# EasyEDA Pro project HDMI_To_AV.epro

# Schematic schematic1
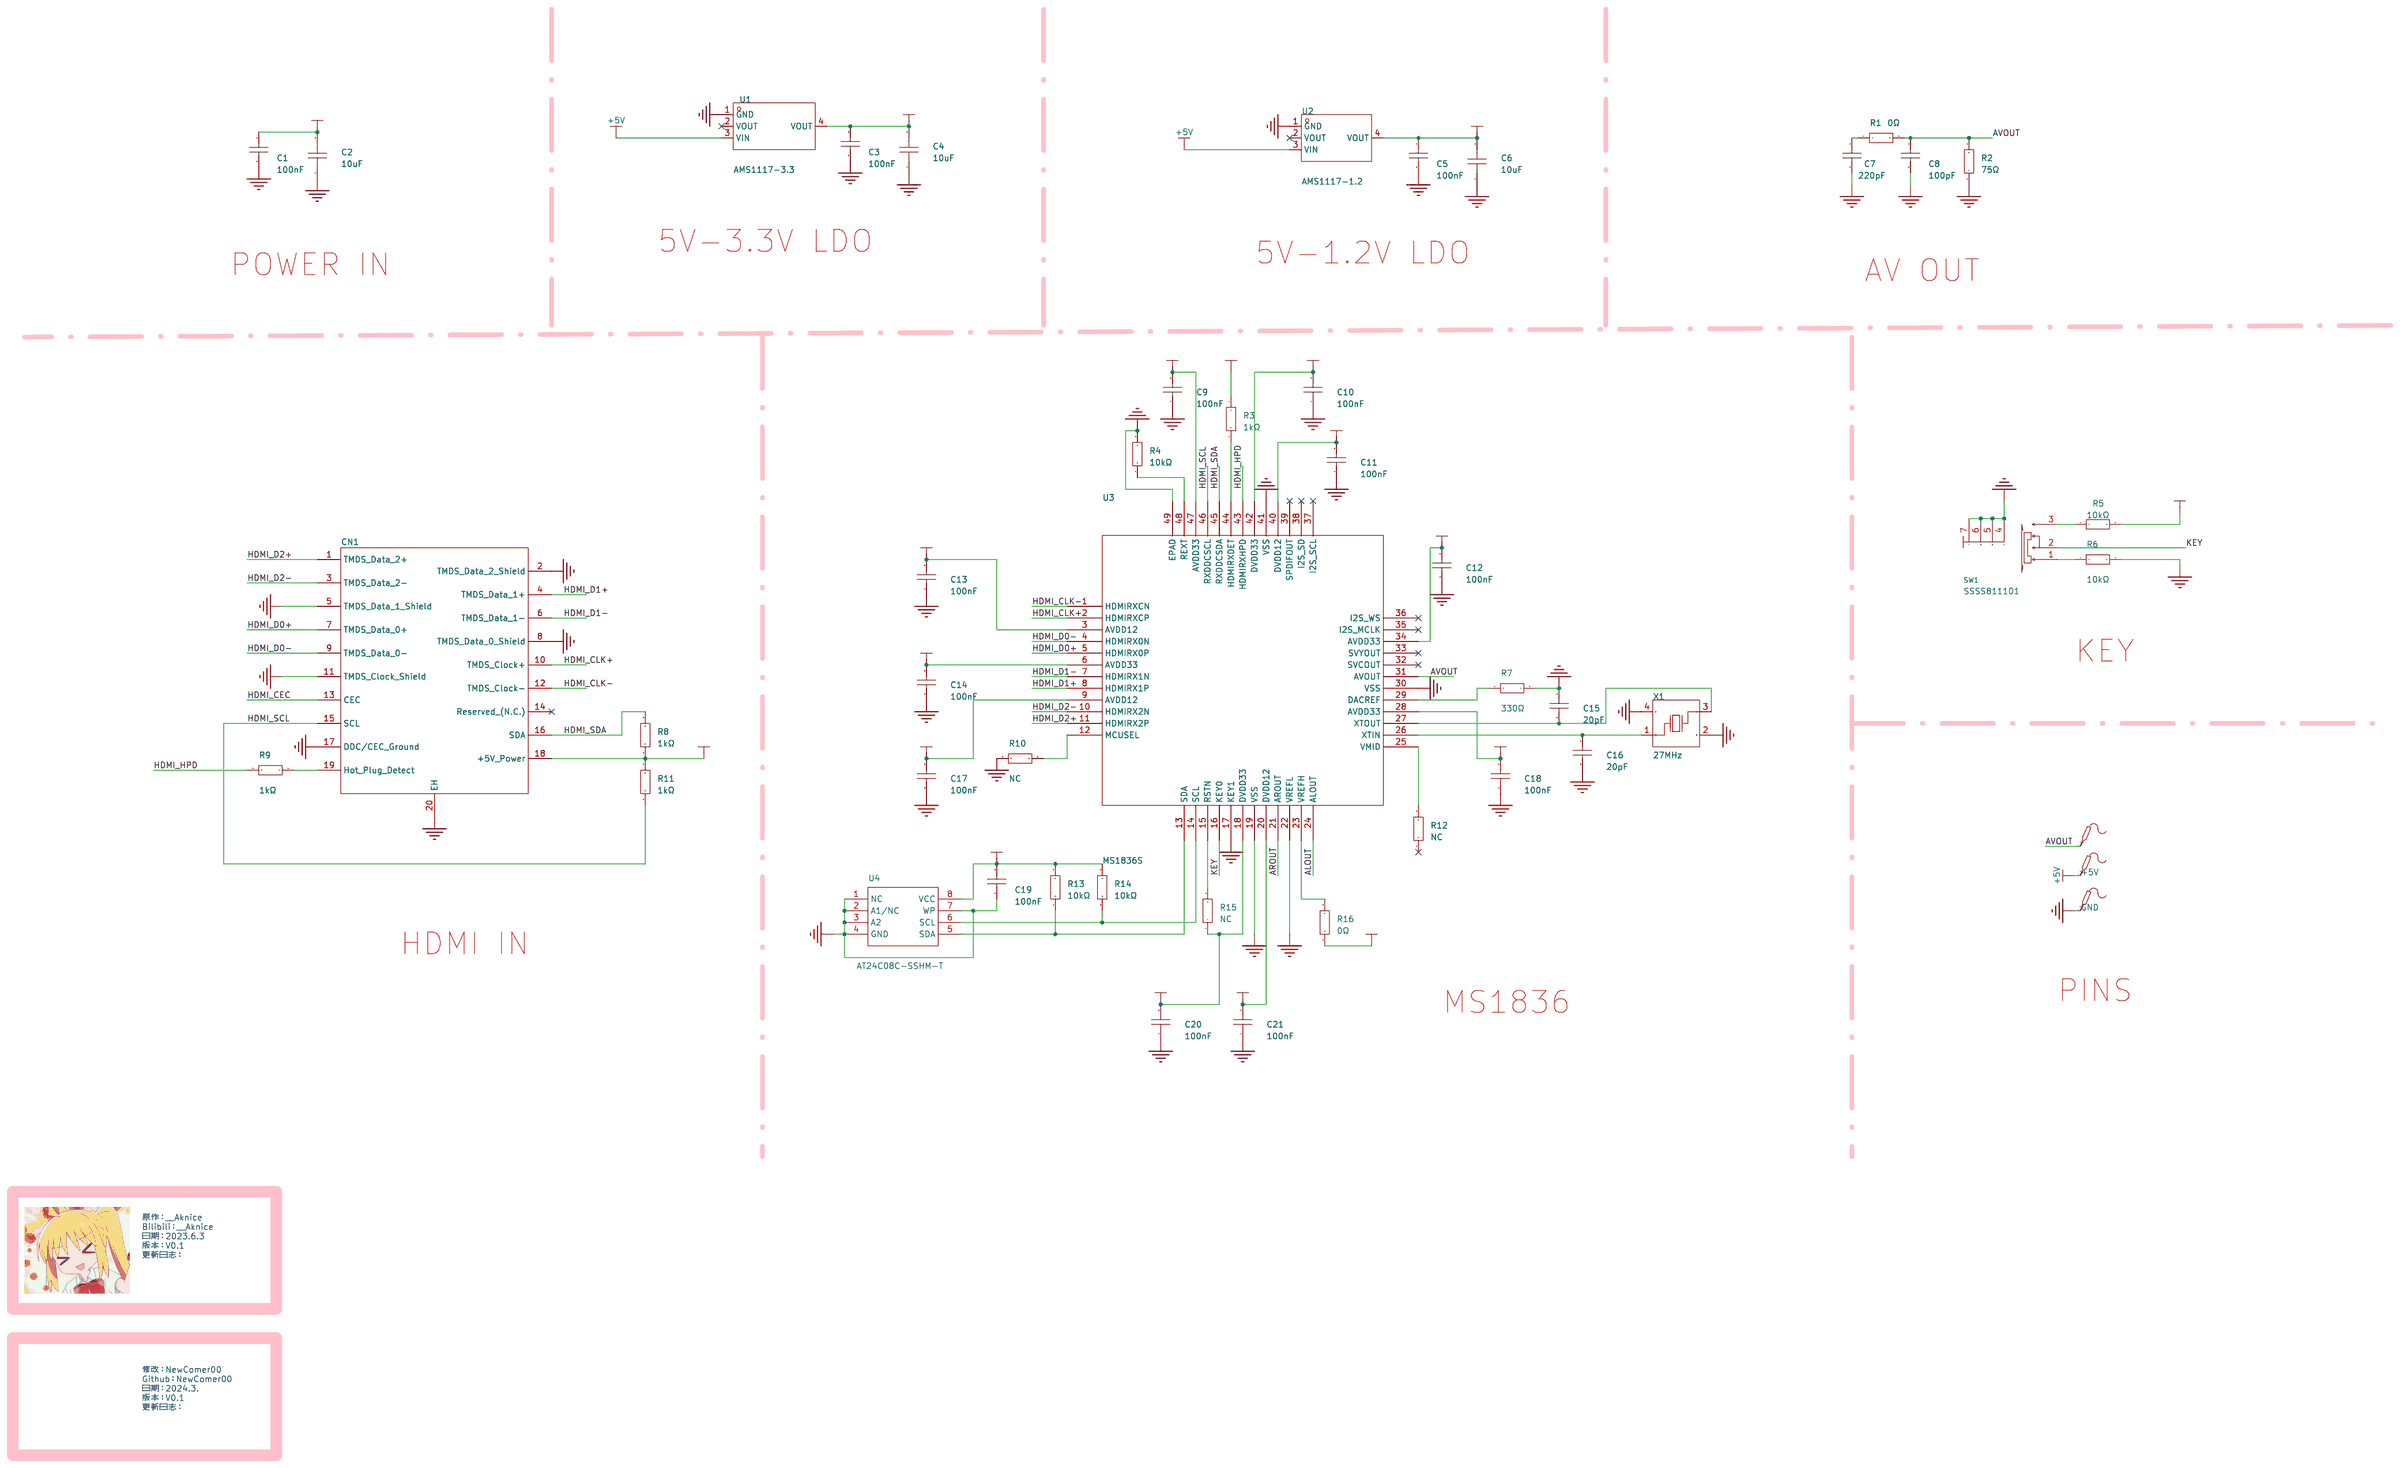
[diagram p0: schematic sheet]

## Parts
+5V  -  [Test-Point-0.5mm]
AVOUT  -  [Test-Point-0.5mm]
C1  100nF  [C0402]
C2  10uF  [C0603]
C3  100nF  [C0402]
C4  10uF  [C0603]
C5  100nF  [C0402]
C6  10uF  [C0603]
C7  220pF  [C0402]
C8  100pF  [C0402]
C9  100nF  [C0402]
C10  100nF  [C0402]
C11  100nF  [C0402]
C12  100nF  [C0402]
C13  100nF  [C0402]
C14  100nF  [C0402]
C15  20pF  [C0402]
C16  20pF  [C0402]
C17  100nF  [C0402]
C18  100nF  [C0402]
C19  100nF  [C0402]
C20  100nF  [C0402]
C21  100nF  [C0402]
CN1  HDMI-019A  [HDMI-TH_HDMI-019A]
GND  -  [Test-Point-0.5mm]
R1  0Ω  [R0805]
R2  75Ω  [R0402]
R3  1kΩ  [R0402]
R4  10kΩ  [R0402]
R5  10kΩ  [R0402]
R6  10kΩ  [R0402]
R7  330Ω  [R0402]
R8  1kΩ  [R0402]
R9  1kΩ  [R0402]
R10  NC  [R0402]
R11  1kΩ  [R0402]
R12  NC  [R0402]
R13  10kΩ  [R0402]
R14  10kΩ  [R0402]
R15  NC  [R0402]
R16  0Ω  [R0402]
SW1  SSSS811101  [SW-SMD_SSSS811101]
U1  AMS1117-3.3  [SOT-223-3_L6.5-W3.4-P2.30-LS7.0-BR]
U2  AMS1117-1.2  [SOT-223-3_L6.7-W3.7-P2.30-LS7.0-BR]
U3  MS1836S  [QFN-48_L7.0-W7.0-P0.50-TL-EP5.4]
U4  AT24C08C-SSHM-T  [SOIC-8_L5.0-W4.0-P1.27-LS6.0-BL]
X1  27MHz  [OSC-SMD_4P-L3.2-W2.5-BL]

## Library data of the parts
+5V AVOUT GND = Test-Point: Test Point 测试点
C1 C3 C5 C9-C14 C17-C21 = CL05B104KO5NNNC: 容值:100nF;精度:±10%;额定电压:16V;材质(温度系数):X7R;; LCSC Part Name: 100nF ±10% 16V; Supplier Part: C1525; Manufacturer: SAMSUNG(三星); Supplier Footprint: 0402; JLCPCB Part Class: 基础库; Datasheet: https://atta.szlcsc.com/upload/public/pdf/source/20160103/1457707674891.pdf; Supplier: LCSC; Tolerance: ±10%; Voltage Rated: 16V; Temperature Coefficient: X7R
C2 C4 C6 = CL10A106KP8NNNC: 容值:10uF;精度:±10%;额定电压:10V;材质(温度系数):X5R;; LCSC Part Name: 10uF ±10% 10V; Supplier Part: C19702; Manufacturer: SAMSUNG(三星); Supplier Footprint: 0603; JLCPCB Part Class: 基础库; Datasheet: https://atta.szlcsc.com/upload/public/pdf/source/20160103/1457707703378.pdf; Supplier: LCSC; Tolerance: ±10%; Voltage Rated: 10V; Temperature Coefficient: X5R
C7 = 0402B221K500NT: 容值:220pF;精度:±10%;额定电压:50V;材质(温度系数):X7R;; LCSC Part Name: 220pF ±10% 50V; Supplier Part: C1530; Manufacturer: FH(风华); Supplier Footprint: 0402; JLCPCB Part Class: 基础库; Datasheet: https://atta.szlcsc.com/upload/public/pdf/source/20170923/C1530_1506149257934988337.pdf; Supplier: LCSC; Tolerance: ±10%; Voltage Rated: 50V; Temperature Coefficient: X7R
C8 = 0402CG101J500NT: 容值:100pF;精度:±5%;额定电压:50V;材质(温度系数):C0G;; LCSC Part Name: 100pF ±5% 50V; Supplier Part: C1546; Manufacturer: FH(风华); Supplier Footprint: 0402; JLCPCB Part Class: 基础库; Datasheet: https://atta.szlcsc.com/upload/public/pdf/source/20170923/C1546_1506149265265988353.pdf; Supplier: LCSC; Tolerance: ±5%; Voltage Rated: 50V; Temperature Coefficient: C0G
C15 C16 = 0402CG200J500NT: 容值:20pF;精度:±5%;额定电压:50V;材质(温度系数):C0G;; LCSC Part Name: 20pF ±5% 50V; Supplier Part: C1554; Manufacturer: FH(风华); Supplier Footprint: 0402; JLCPCB Part Class: 基础库; Datasheet: https://atta.szlcsc.com/upload/public/pdf/source/20170923/C1554_1506149268708988361.pdf; Supplier: LCSC; Tolerance: ±5%; Voltage Rated: 50V; Temperature Coefficient: C0G
CN1 = HDMI-019A: 连接器类型:HDMI;公母:母;总PIN位数:19;排数:-;安装方式:弯插;额定电流:500mA;工作温度范围:-25~+75;; LCSC Part Name: HDMI 母 P数:19; Supplier Part: C369072; Manufacturer: SOFNG(硕方); Supplier Footprint: 插件; JLCPCB Part Class: 扩展库; Datasheet: https://atta.szlcsc.com/upload/public/pdf/source/20191127/C369072_B9A70961842C25AB549748627DCDC9C3.pdf; Supplier: LCSC; Connector Type: HDMI; Gender: 母; Number of Pins: 19; Mounting Style: 弯插; Current Rating (Max): 500mA; Operating Temperature Range: -25~+75
R1 = 0805W8F0000T5E: 电阻类型:厚膜电阻;阻值:0Ω;精度:±1%;功率:125mW;; LCSC Part Name: 0Ω ±1% 125mW; Supplier Part: C17477; Manufacturer: UNI-ROYAL(厚声); Supplier Footprint: 0805; JLCPCB Part Class: Basic Part; Datasheet: https://atta.szlcsc.com/upload/public/pdf/source/20200306/C422600_1E6D84923E4A46A82E41ADD87F860B5C.pdf; Supplier: LCSC; Type: 厚膜电阻; Tolerance: ±1%; Power(Watts): 125mW; Temperature Coefficient: ±800ppm/℃; Overload Voltage (Max): 150V; Operating Temperature Range: -55℃~+155℃
R2 = 0402WGF750JTCE: 电阻类型:厚膜电阻;阻值:75Ω;精度:±1%;功率:62.5mW;; LCSC Part Name: 75Ω ±1% 62.5mW; Supplier Part: C25133; Manufacturer: UNI-ROYAL(厚声); Supplier Footprint: 0402; JLCPCB Part Class: Basic Part; Datasheet: https://atta.szlcsc.com/upload/public/pdf/source/20200306/C422600_1E6D84923E4A46A82E41ADD87F860B5C.pdf; Supplier: LCSC; Type: 厚膜电阻; Tolerance: ±1%; Power(Watts): 62.5mW; Temperature Coefficient: ±100ppm/℃; Overload Voltage (Max): 50V; Operating Temperature Range: -55℃~+155℃
R3 R8 R9 R11 = 0402WGJ0102TCE: 电阻类型:厚膜电阻;阻值:1kΩ;精度:±5%;功率:62.5mW;; LCSC Part Name: 1kΩ ±5% 62.5mW; Supplier Part: C25543; Manufacturer: UNI-ROYAL(厚声); Supplier Footprint: 0402; JLCPCB Part Class: Extended Part; Datasheet: https://atta.szlcsc.com/upload/public/pdf/source/20200306/C422600_1E6D84923E4A46A82E41ADD87F860B5C.pdf; Supplier: LCSC; Type: 厚膜电阻; Tolerance: ±5%; Power(Watts): 62.5mW; Temperature Coefficient: ±100ppm/℃; Overload Voltage (Max): 50V; Operating Temperature Range: -55℃~+155℃
R4-R6 R13 R14 = 0402WGF1002TCE: 电阻类型:厚膜电阻;阻值:10kΩ;精度:±1%;功率:62.5mW;; LCSC Part Name: 10kΩ ±1% 62.5mW; Supplier Part: C25744; Manufacturer: UNI-ROYAL(厚声); Supplier Footprint: 0402; JLCPCB Part Class: Basic Part; Datasheet: https://atta.szlcsc.com/upload/public/pdf/source/20200306/C422600_1E6D84923E4A46A82E41ADD87F860B5C.pdf; Supplier: LCSC; Type: 厚膜电阻; Tolerance: ±1%; Power(Watts): 62.5mW; Temperature Coefficient: ±100ppm/℃; Overload Voltage (Max): 50V; Operating Temperature Range: -55℃~+155℃
R7 = 0402WGF3300TCE: 电阻类型:厚膜电阻;阻值:330Ω;精度:±1%;功率:62.5mW;; LCSC Part Name: 330Ω ±1% 62.5mW; Supplier Part: C25104; Manufacturer: UNI-ROYAL(厚声); Supplier Footprint: 0402; JLCPCB Part Class: 基础库; Datasheet: https://atta.szlcsc.com/upload/public/pdf/source/20200306/C422600_1E6D84923E4A46A82E41ADD87F860B5C.pdf; Supplier: LCSC; Type: 厚膜电阻; Tolerance: ±1%; Power(Watts): 62.5mW; Temperature Coefficient: ±100ppm/℃; Overload Voltage (Max): 50V; Operating Temperature Range: -55℃~+155℃
R10 R12 R15 R16 = 0402WGF0000TCE: 电阻类型:厚膜电阻;阻值:0Ω;精度:±1%;功率:62.5mW;; LCSC Part Name: 0Ω ±1% 62.5mW; Supplier Part: C17168; Manufacturer: UNI-ROYAL(厚声); Supplier Footprint: 0402; JLCPCB Part Class: 基础库; Datasheet: https://atta.szlcsc.com/upload/public/pdf/source/20200306/C422600_1E6D84923E4A46A82E41ADD87F860B5C.pdf; Supplier: LCSC; Type: 厚膜电阻; Tolerance: ±1%; Power(Watts): 62.5mW; Temperature Coefficient: ±800ppm/℃; Overload Voltage (Max): 50V; Operating Temperature Range: -55℃~+155℃
SW1 = SSSS811101: 电路结构:单刀双掷;安装方式:卧贴;额定电流(DC):300mA;额定电压(DC):5V;额定电流(AC):-;额定电压(AC):-;机械寿命:1万次;; Supplier Part: C109335; Manufacturer: ALPSALPINE(阿尔卑斯阿尔派); Supplier Footprint: SMD; JLCPCB Part Class: 扩展库; Datasheet: https://atta.szlcsc.com/upload/public/pdf/source/20170620/1497944730069.pdf; Supplier: LCSC; Circuit: 单刀双掷; Actuator Style: 矩形柱状; Pin Style: SMD接片; Switch Height: 4.1mm; Mounting Style: 卧贴; Current Rating (DC): 300mA; Voltage Rating (DC): 5V; Mechanical Life: 1万次; Operating Temperature: -40℃~+85℃
U1 = AMS1117-3.3_C6186: 输出类型:固定;输出极性:正;最大输入电压:-;输出电压:3.3V;输出电流:1A;电源纹波抑制比(PSRR):72dB@(120Hz);; LCSC Part Name: 输出3.3V 1A; Supplier Part: C6186; Manufacturer: AMS; Supplier Footprint: SOT-223; JLCPCB Part Class: Basic Part; Datasheet: https://atta.szlcsc.com/upload/public/pdf/source/20180727/C6186_7A095716F0823C02F1997A905E26C086.pdf; Supplier: LCSC; Output Type: 固定; Output Polarity: 正; Number of Outputs: 1; Output Voltage: 3.3V; Dropout Voltage: 1.3V@(800mA); Output Current: 1A; Power Supply Rejection Ratio (PSRR): 72dB@(120Hz)
U2 = AMS1117-1.2_C963402: 输出类型:-;; Supplier Part: C963402; Manufacturer: JSMSEMI(杰盛微); Supplier Footprint: SOT-223-3; JLCPCB Part Class: 扩展库; Datasheet: https://atta.szlcsc.com/upload/public/pdf/source/20211201/578FEEF9766904D398893791CE3EC879.pdf; Supplier: LCSC
U3 = MS1836S
U4 = AT24C08C-SSHM-T: 接口类型:I2C;存储容量:8Kbit;; Supplier Part: C31422; Manufacturer: MICROCHIP(美国微芯); Supplier Footprint: SOIC-8; JLCPCB Part Class: 扩展库; Datasheet: https://atta.szlcsc.com/upload/public/pdf/source/20210426/C31422_4DD9E0195B8FA1A8955CD672FFF5D6C7.pdf; Supplier: LCSC; Interface Type: I2C; Memory Size: 8Kbit; Supply Voltage: 1.7V~5.5V; Operating Temperature: -40℃~85℃
X1 = X322527MSB4SI: 频率:27MHz;频率公差:±10ppm;负载电容:20pF;; LCSC Part Name: 27MHz ±10ppm 20pF; Supplier Part: C9008; Manufacturer: YXC(扬兴晶振); Supplier Footprint: SMD3225-4P; JLCPCB Part Class: 扩展库; Datasheet: https://atta.szlcsc.com/upload/public/pdf/source/20210924/6E7747CDA2F2290AC736DA7D858AE7E6.pdf; Supplier: LCSC; Crystal Type: 贴片无源晶振; Frequency Tolerance: ±10ppm; Frequency Stability: ±30ppm; Load Capacitance: 20pF; Operating Temperature: -40℃~+85℃

## Nets
+1.2V: C5.2 C6.2 C11.2 C13.2 C17.2 C21.2 U2.4(VOUT) U3.3(AVDD12) U3.9(AVDD12) U3.20(DVDD12) U3.40(DVDD12)
+3.3V: C3.2 C4.2 C9.2 C10.2 C12.2 C14.2 C18.2 C19.2 C20.2 R5.2 R13.2 R14.2 R15.1 R16.1 U1.4(VOUT) U3.6(AVDD33) U3.18(DVDD33) U3.28(AVDD33) U3.34(AVDD33) U3.42(DVDD33) U3.47(AVDD33) U4.8(VCC)
+5V: +5V.1 C1.2 C2.2 U1.3(VIN) U2.3(VIN)
GND: C1.1 C2.1 C3.1 C4.1 C5.1 C6.1 C7.1 C8.1 C9.1 C10.1 C11.1 C12.1 C13.1 C14.1 C15.2 C16.1 C17.1 C18.1 C19.1 C20.1 C21.1 CN1.2(TMDS Data 2 Shield) CN1.5(TMDS Data 1 Shield) CN1.8(TMDS Data 0 Shield) CN1.11(TMDS Clock Shield) CN1.17(DDC/CEC Ground) CN1.20(EH) GND.1 R2.1 R4.2 R6.2 R7.2 R10.2 SW1.4 SW1.5 SW1.6 SW1.7 U1.1(GND) U2.1(GND) U3.17(KEY1) U3.19(VSS) U3.22(VREFL) U3.30(VSS) U3.41(VSS) U3.49(EPAD) U4.1(NC) U4.2(A1/NC) U4.3(A2) U4.4(GND) U4.7(WP) X1.2(GND) X1.4(GND)
ALOUT: U3.24(ALOUT)
AROUT: U3.21(AROUT)
AVOUT: AVOUT.1 C8.2 R1.2 R2.2 U3.31(AVOUT)
HDMI_CEC: CN1.13(CEC)
HDMI_CLK+: CN1.10(TMDS Clock+) U3.2(HDMIRXCP)
HDMI_CLK-: CN1.12(TMDS Clock-) U3.1(HDMIRXCN)
HDMI_D0+: CN1.7(TMDS Data 0+) U3.5(HDMIRX0P)
HDMI_D0-: CN1.9(TMDS Data 0-) U3.4(HDMIRX0N)
HDMI_D1+: CN1.4(TMDS Data 1+) U3.8(HDMIRX1P)
HDMI_D1-: CN1.6(TMDS Data 1-) U3.7(HDMIRX1N)
HDMI_D2+: CN1.1(TMDS Data 2+) U3.11(HDMIRX2P)
HDMI_D2-: CN1.3(TMDS Data 2-) U3.10(HDMIRX2N)
HDMI_HPD: R9.2 U3.43(HDMIRXHPD)
HDMI_SCL: CN1.15(SCL) R11.1 U3.46(RXDDCSCL)
HDMI_SDA: CN1.16(SDA) R8.2 U3.45(RXDDCSDA)
KEY: SW1.2 U3.16(KEY0)
RX5V: CN1.18(+5V Power) R3.1 R8.1 R11.2
$1N3947: C7.2 R1.1
$1N4157: CN1.19(Hot Plug Detect) R9.1
$1N4897: R14.1 U3.14(SCL) U4.6(SCL)
$1N4904: R13.1 U3.13(SDA) U4.5(SDA)
$1N5015: C16.2 U3.26(XTIN) X1.1(OSC1)
$1N5018: C15.1 U3.27(XTOUT) X1.3(OSC2)
$1N5095: R12.2 U3.25(VMID)
$1N5166: R7.1 U3.29(DACREF)
$1N5224: R4.1 U3.48(REXT)
$1N5407: R3.2 U3.44(HDMIRXDET)
$1N5897: R16.2 U3.23(VREFH)
$1N6045: R15.2 U3.15(RSTN)
$1N6128: R10.1 U3.12(MCUSEL)
$1N14503: R6.1 SW1.1
$1N14505: R5.1 SW1.3

Not connected (* = marked no-connect by the designer): CN1 14(Reserved (N.C.))*; R12 1*; U1 2(VOUT)*; U2 2(VOUT)*; U3 32(SVCOUT)* 33(SVYOUT)* 35(I2S_MCLK)* 36(I2S_WS)* 37(I2S_SCL)* 38(I2S_SD)* 39(SPDIFOUT)*

## Notes on the sheet
- 5V-3.3V LDO
- POWER IN
- 5V-1.2V LDO
- AV OUT
- KEY
- HDMI IN
- PINS
- MS1836
- 原作：__Aknice
  Bilibili：__Aknice
  日期：2023.6.3
  版本：V0.1
  更新日志：
- 修改：NewComer00
  Github：NewComer00
  日期：2024.3.
  版本：V0.1
  更新日志：

# Board PCB1
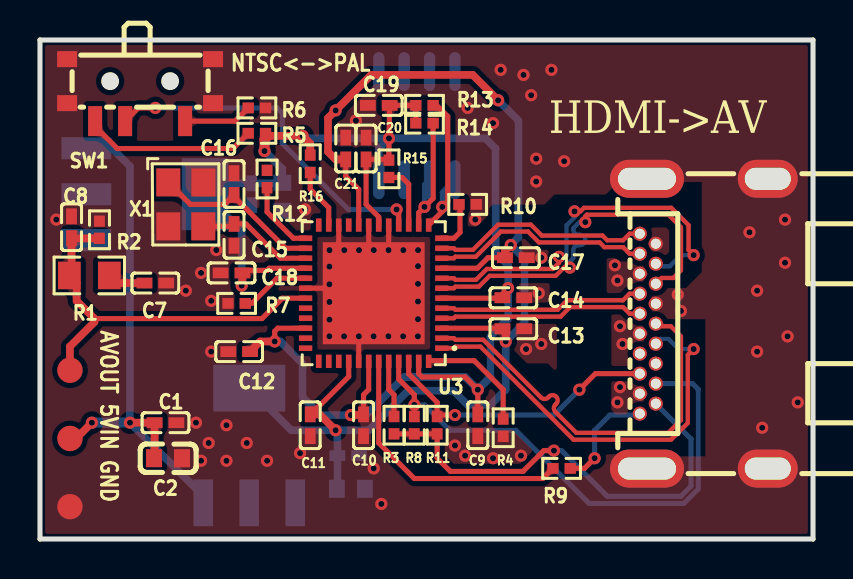
[diagram p1: board, top side]
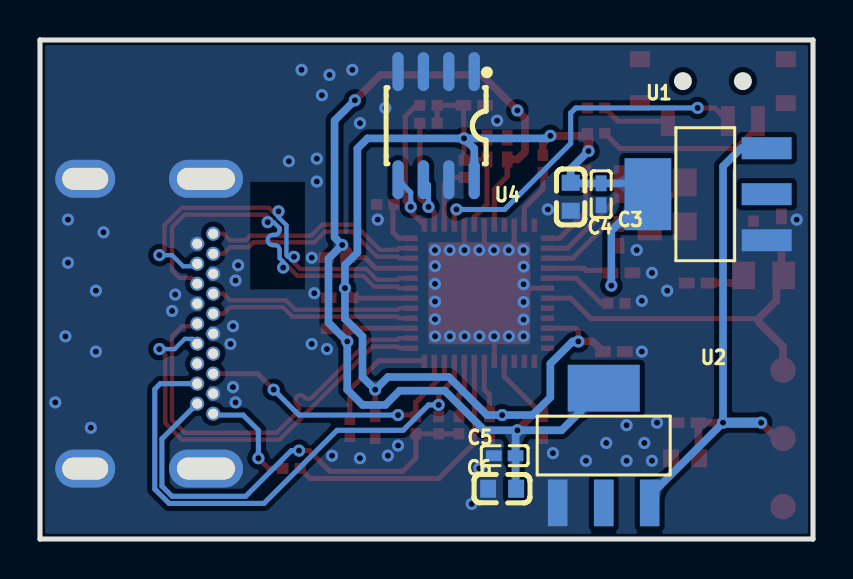
[diagram p2: board, bottom side, seen from below]

Outline 38.67 x 24.97 mm; copper layers: Top Layer, Bottom Layer. Coordinates in mm from the lower left corner of the outline.
Outline path: 0,24.97 38.67,24.97 38.67,0 0,0 0,24.97
Stack: Top Layer 0.035mm - / Dielectric1 0.91mm FR4 er 4.5 / Bottom Layer 0.035mm -

## Design rules (mm)
net HDMI_D2+: HDMI1
net HDMI_D2-: HDMI1
net HDMI_D1+: HDMI2
net HDMI_D1-: HDMI2
net HDMI_D0+: HDMI3
net HDMI_D0-: HDMI3
net HDMI_CLK+: HDMI4
net HDMI_CLK-: HDMI4
template: 自定义配置
spacing copperThickness1oz (default): track to track 0.102, other pairs 0.152 to 0.3
spacing copperThickness2oz: track to track 0.203, other pairs 0.152 to 0.3
track width copperThickness1oz (default): min 0.127, default 0.254, max 2.54
track width copperThickness2oz: min 0.203, default 0.254, max 2.54
differential pair differentialPair (default): width min 0.216, default 0.216, max 0.216; gap min 0.127, default 0.127
via viaSize (default): diameter min 0.5, default 0.61, max 10; hole min 0.249, default 0.305, max 6.299

## Placement (name value [footprint] x y rotation side)
+5V  -  [Test-Point-0.5mm]  1.5 5.03 0 top
AVOUT  -  [Test-Point-0.5mm]  1.5 8.44 0 top
C1  100nF  [C0402]  6.28 5.82 180 top
C2  10uF  [C0603]  6.41 4.04 180 top
C3  100nF  [C0402]  10.6 17.25 90 bottom
C4  10uF  [C0603]  12.12 17.12 90 bottom
C5  100nF  [C0402]  15.42 4.17 180 bottom
C6  10uF  [C0603]  15.55 2.52 180 bottom
C7  220pF  [C0402]  5.77 12.81 180 top
C8  100pF  [C0402]  1.58 15.6 270 top
C9  100nF  [C0402]  21.9 5.69 90 top
C10  100nF  [C0402]  16.18 5.69 90 top
C11  100nF  [C0402]  13.52 5.69 90 top
C12  100nF  [C0402]  9.96 9.38 0 top
C13  100nF  [C0402]  23.68 10.52 180 top
C14  100nF  [C0402]  23.68 12.07 180 top
C15  20pF  [C0402]  9.71 15.22 270 top
C16  20pF  [C0402]  9.71 17.76 270 top
C17  100nF  [C0402]  23.8 14.08 180 top
C18  100nF  [C0402]  9.58 13.31 0 top
C19  100nF  [C0402]  16.95 21.7 0 top
C20  100nF  [C0402]  16.31 19.54 270 top
C21  100nF  [C0402]  15.29 19.54 270 top
CN1  HDMI-019A  [HDMI-TH_HDMI-019A]  33.2 10.77 90 top
GND  -  [Test-Point-0.5mm]  1.5 1.62 0 top
R1  0Ω  [R0805]  2.47 13.19 180 top
R2  75Ω  [R0402]  2.98 15.47 270 top
R3  1kΩ  [R0402]  17.71 5.69 90 top
R4  10kΩ  [R0402]  23.17 5.57 270 top
R5  10kΩ  [R0402]  10.85 20.3 0 top
R6  10kΩ  [R0402]  10.85 21.57 0 top
R7  330Ω  [R0402]  9.83 11.79 180 top
R8  1kΩ  [R0402]  18.72 5.69 90 top
R9  1kΩ  [R0402]  26.09 3.53 180 top
R10  NC  [R0402]  21.39 16.74 0 top
R11  1kΩ  [R0402]  19.87 5.69 270 top
R12  NC  [R0402]  11.36 18.01 270 top
R13  10kΩ  [R0402]  19.23 21.7 180 top
R14  10kΩ  [R0402]  19.23 20.81 180 top
R15  NC  [R0402]  17.45 18.52 270 top
R16  0Ω  [R0402]  13.52 18.77 270 top
SW1  SSSS811101  [SW-SMD_SSSS811101]  5.01 22.46 180 top
U1  AMS1117-3.3  [SOT-223-3_L6.5-W3.4-P2.30-LS7.0-BR]  5.29 17.25 180 bottom
U2  AMS1117-1.2  [SOT-223-3_L6.7-W3.7-P2.30-LS7.0-BR]  10.47 4.68 270 bottom
U3  MS1836S  [QFN-48_L7.0-W7.0-P0.50-TL-EP5.4]  16.69 12.3 180 top
U4  AT24C08C-SSHM-T  [SOIC-8_L5.0-W4.0-P1.27-LS6.0-BL]  18.85 20.68 0 bottom
X1  27MHz  [OSC-SMD_4P-L3.2-W2.5-BL]  7.29 16.74 270 top

## Footprints (pads in the part's own frame, mm; a bottom-side part is the same pattern mirrored in y, then rotated)
C0402
  rect 0.79x0.54 smd: 1(-0.545,0) 2(0.545,0)
C0603
  rect 0.8x0.9 smd: 1(-0.7,0) 2(0.7,0)
HDMI-TH_HDMI-019A
  round 0.701 hole 0.5: 1(4.501,3.2) 2(4,2.401) 3(3.5,3.2) 4(2.999,2.401) 5(2.499,3.2) 6(1.999,2.401) 7(1.501,3.2) 8(1.001,2.401) 9(0.5,3.2) 10(0,2.401) 11(-0.5,3.2) 12(-1.001,2.401) 13(-1.498,3.2) 14(-1.999,2.401) 15(-2.499,3.2) 16(-2.999,2.401) 17(-3.5,3.2) 18(-4,2.401) 19(-4.501,3.2)
  oval 1.9x3.701 hole 1.1x2.901: 20(-7.249,2.84) 20(7.249,2.84)
  oval 1.9x2.999 hole 1.1x2.301: 20(-7.249,-3.2) 20(7.249,-3.2)
OSC-SMD_4P-L3.2-W2.5-BL
  rect 1.4x1.2 smd: 1(-1.1,-0.875) 2(1.1,-0.875) 3(1.1,0.875) 4(-1.1,0.875)
QFN-48_L7.0-W7.0-P0.50-TL-EP5.4
  rect 0.665x0.28 smd: 1(-3.408,2.75) 2(-3.408,2.25) 3(-3.408,1.75) 4(-3.408,1.25) 5(-3.408,0.75) 6(-3.408,0.25) 7(-3.408,-0.25) 8(-3.408,-0.75) 9(-3.408,-1.25) 10(-3.408,-1.75) 11(-3.408,-2.25) 12(-3.408,-2.75) 25(3.408,-2.75) 26(3.408,-2.25) 27(3.408,-1.75) 28(3.408,-1.25) 29(3.408,-0.75) 30(3.408,-0.25) 31(3.408,0.25) 32(3.408,0.75) 33(3.408,1.25) 34(3.408,1.75) 35(3.408,2.25) 36(3.408,2.75)
  rect 0.28x0.665 smd: 13(-2.75,-3.408) 14(-2.25,-3.408) 15(-1.75,-3.408) 16(-1.25,-3.408) 17(-0.75,-3.408) 18(-0.25,-3.408) 19(0.25,-3.408) 20(0.75,-3.408) 21(1.25,-3.408) 22(1.75,-3.408) 23(2.25,-3.408) 24(2.75,-3.408) 37(2.75,3.408) 38(2.25,3.408) 39(1.75,3.408) 40(1.25,3.408) 41(0.75,3.408) 42(0.25,3.408) 43(-0.25,3.408) 44(-0.75,3.408) 45(-1.25,3.408) 46(-1.75,3.408) 47(-2.25,3.408) 48(-2.75,3.408)
  rect 5.1x5.1 smd: 49(0,0)
R0402
  rect 0.566x0.54 smd: 1(-0.433,0) 2(0.433,0)
R0805
  rect 1.133x1.377 smd: 1(-1,0) 2(1,0)
SOIC-8_L5.0-W4.0-P1.27-LS6.0-BL
  oval 0.569x1.95 smd: 1(-1.905,-2.705) 2(-0.635,-2.705) 3(0.635,-2.705) 4(1.905,-2.705) 5(1.905,2.705) 6(0.635,2.705) 7(-0.635,2.705) 8(-1.905,2.705)
SOT-223-3_L6.5-W3.4-P2.30-LS7.0-BR
  rect 2.5x1.1 smd: 1(2.97,-2.3) 2(2.97,0) 3(2.97,2.3)
  rect 2.34x3.6 smd: 4(-2.97,0)
SOT-223-3_L6.7-W3.7-P2.30-LS7.0-BR
  rect 2.34x0.98 smd: 1(2.87,-2.3) 2(2.87,0) 3(2.87,2.3)
  rect 2.34x3.6 smd: 4(-2.87,0)
SW-SMD_SSSS811101
  rect 0.7x1.5 smd: 1(-2.25,1.55) 2(0.75,1.55) 3(2.25,1.55)
  rect 1x0.8 smd: 4(-3.65,0.65) 5(3.65,0.65) 6(3.65,-1.55) 7(-3.65,-1.55)
Test-Point-0.5mm
  round 1.27 smd: 1(0,0)

## Nets
As in the schematic.

Pads without a net: CN1 14; R12 1; U1 2; U2 2; U3 32 33 35 36 37 38 39

## Via types
v1: diameter 0.61, hole 0.305, Top Layer to Bottom Layer, 104 vias

## Routing (per net, layer and track width the routed paths; a pad name or vN(x,y) marks a point on that pad's centre or on a via; arc(x,y) is an arc through that point)
+1.2V: length 63.2
  Top Layer w0.254: 13.55,6.24 15.44,8.13 15.44,8.92 ; 23.26,14.08 22.41,14.08 21.88,13.55 20.07,13.55 ; U3.20 15.94,17.49 15.29,18.14 C21.2 ; 15.94,15.67 15.93,15.68 ; 23.1,10.55 20.07,10.55
  Top Layer w0.381: v1(14.79,5.44) 13.99,6.24 C11.2 ; v1(23.55,14.71) 23.26,14.42 23.26,14.08 ; C21.2 14.79,18.99 14.41,19.37 14.41,21.06 v1(14.79,21.44) 16.56,23.22 21.65,23.22 v1(22.91,21.95) ; 23,10.58 23.3,10.28 v1(23.3,9.88)
  Bottom Layer w0.381: v1(14.79,5.44) 16.44,5.44 18.42,7.42 20.68,7.42 21.39,6.71 22.53,6.71 23.3,7.47 v1(23.3,9.88) 24.24,10.82 24.24,14.02 v1(23.55,14.71) 23.93,15.09 23.93,20.93 v1(22.91,21.95) ; v1(14.79,5.44) 14.88,5.35 C5.2 14.88,2.55 C6.2 ; v1(14.79,5.44) 12.58,5.44 U2.4
+3.3V: length 83.5
  Top Layer w0.254: 11.41,20.17 R5.2 ; 23.3,12.42 22.92,12.05 20.07,12.05 ; U3.18 16.95,15.71 16.95,16.11 16.31,16.74 C20.2 17.42,18.99 R15.1 v1(17.45,20.04) C19.2 R13.2 R14.2 ; 16.44,8.92 16.44,7.48 16.18,7.22 C10.2 ; 18.94,8.92 18.94,8.27 19.1,8.11 21.26,8.11 v1(21.9,7.47) C9.2 ; 10.12,13.31 10.25,13.44 11.36,13.44 11.47,13.55 13.32,13.55 ; v1(11.74,9.88) 11.74,10.39 11.89,10.55 U3.34
  Top Layer w0.381: 23.3,12.33 23.3,12.44 v1(23.41,12.55) ; C10.2 16.15,6.2 v1(15.55,6.2) ; 11.41,20.17 v1(13.14,20.17) 13.52,19.79 R16.1 ; v1(10.09,12.68) 10.12,12.72 10.12,13.31 ; C12.2 11.01,9.88 v1(11.74,9.88)
  Top Layer w0.508: v1(11.23,19.41) 11.23,19.99 11.41,20.17
  Bottom Layer w0.381: v1(17.45,20.04) 22.28,20.04 22.79,19.54 22.79,14.33 23.41,13.71 v1(23.41,12.55) 23.41,11.02 22.53,10.14 22.53,8.11 v1(21.9,7.47) 21.26,8.11 18.22,8.11 16.31,6.2 v1(15.55,6.2) 14.03,6.2 13.14,7.09 13.14,8.77 12.02,9.88 v1(11.74,9.88) ; v1(17.45,20.04) 16.95,19.54 U4.8 ; v1(17.45,20.04) 13.26,20.04 v1(13.14,20.17) ; v1(11.23,19.41) 12.12,18.52 C4.2 12.09,17.8 C3.2 8.8,17.8 U1.4 10.09,15.42 v1(10.09,12.68)
+5V: length 27.3
  Top Layer w0.381: C2.2 5.73,4.07 C1.2 v1(4.5,5.82) ; +5V.1 1.81,5.03 v1(2.59,5.82)
  Bottom Layer w0.381: U1.3 3.6,19.55 4.5,18.65 v1(4.5,5.82) 8.17,2.15 U2.3
  Bottom Layer w0.508: v1(4.5,5.82) v1(2.59,5.82)
GND: length 5.8
  Top Layer w0.254: 15.18,14.57 14.94,14.81 14.94,15.67 ; 16.69,14.57 16.44,14.82 16.44,15.67 ; 13.32,12.55 14.17,12.55 14.42,12.3 ; 17.44,15.67 17.44,14.58 17.45,14.57 ; 15.94,8.92 15.94,10.02 15.93,10.02
  vias: v1(0.82,15.98) v1(7.29,12.42) v1(7.8,5.82) v1(8.06,13.31) v1(8.06,3.92) v1(8.44,4.8) v1(8.56,11.92) v1(8.56,9.38) v1(8.82,14.46) v1(9.33,5.69) v1(9.33,3.92) v1(10.34,4.8) v1(11.36,3.92) v1(13.01,4.3) v1(13.26,16.49) v1(14.48,14.45) v1(14.48,13.63) v1(14.48,12.74) v1(14.48,11.86) v1(14.48,10.98) v1(14.47,10.14) v1(15.21,10.14) v1(15.22,14.45) v1(15.8,20.93) v1(15.96,14.45) v1(15.95,10.14) v1(16.7,14.45) v1(16.69,10.14) v1(16.69,3.53) v1(17.07,1.76) v1(17.43,14.45) v1(17.43,10.14) v1(18.17,14.45) v1(18.16,10.14) v1(18.91,14.45) v1(18.91,13.65) v1(18.91,12.77) v1(18.91,11.88) v1(18.91,11) v1(18.9,10.14) v1(20.76,4.68) v1(21.26,4.17) v1(21.39,21.57) v1(21.77,15.98) v1(22.66,20.81) v1(22.66,4.04) v1(23.04,23.47) v1(24.06,4.17) v1(24.19,23.22) v1(24.31,9.5) v1(24.57,22.2) v1(24.82,19.03) v1(24.82,17.89) v1(24.95,12.3) v1(25.07,14.08) v1(25.07,9.76) v1(25.58,23.47) v1(26.22,18.9) v1(28.76,13.69) v1(28.88,12.93) v1(28.88,6.84) v1(29.01,10.65) v1(29.01,7.6) v1(29.14,9.76) v1(31.9,12.23) v1(32.06,11.41) v1(35.49,15.35) v1(35.87,12.42) v1(35.87,9.38) v1(36.12,5.57) v1(37.27,15.98) v1(37.27,13.82) v1(37.39,10.14) v1(37.9,6.84)
AVOUT: length 19.9
  Top Layer w0.254: U3.31 12.12,12.05 11.1,11.03 2.72,11.03
  Top Layer w0.381: 1.58,13.3 C8.2 1.59,15.04 R2.2 ; R1.2 1.83,12.82 1.83,11.92 2.72,11.03 2.72,10.86 1.5,9.63 AVOUT.1
HDMI_CLK+: length 20.6
  Top Layer w0.216: 20.07,10.05 20.7,10.05 20.78,9.97 22.17,9.97 25.06,7.08 arc(25.24,7.01) 25.42,7.08 25.46,7.12 arc(25.82,7.12) 25.82,6.76 25.78,6.72 arc(25.7,6.54) 25.78,6.36 26.83,5.31 31.42,5.31 32.06,5.95 32.06,10.14 31.55,10.65 30.93,10.65 CN1.10
HDMI_CLK-: length 20.7
  Top Layer w0.216: v1(32.69,9.5) 32.4,9.21 32.4,5.81 31.57,4.97 26.69,4.97 22.03,9.63 20.78,9.63 20.7,9.55 20.07,9.55
  Bottom Layer w0.216: v1(32.69,9.5) 31.93,9.5 31.42,10.01 31.04,10.01 CN1.12
HDMI_D0+: length 10.3
  Top Layer w0.216: CN1.7 29.49,12.27 29.16,11.95 26.37,11.95 25.9,11.47 20.78,11.47 20.7,11.55 20.07,11.55
HDMI_D0-: length 10.3
  Top Layer w0.216: 20.07,11.05 20.7,11.05 20.78,11.13 26.04,11.13 26.51,11.6 29.16,11.6 29.49,11.27 CN1.9
HDMI_D1+: length 19.3
  Top Layer w0.216: v1(26.74,16.39) 27.03,16.39 27.21,16.57 31.57,16.57 32.44,15.7 32.44,14.46 v1(32.69,14.2) ; 20.07,13.05 20.7,13.05 20.78,12.97 21.81,12.97 22.35,13.51 25.65,13.51 25.96,13.82 v1(25.96,14.12)
  Bottom Layer w0.216: v1(25.96,14.12) 26.26,14.12 26.34,14.19 26.34,15.69 26.74,16.1 v1(26.74,16.39) ; v1(32.69,14.2) 32.06,14.2 31.5,13.65 30.93,13.65 CN1.4
HDMI_D1-: length 19.5
  Top Layer w0.216: CN1.6 31.09,13.06 31.68,13.06 32.06,13.44 32.06,15.6 31.43,16.23 27.35,16.23 27.28,16.15 v1(27.28,15.85) ; 20.07,12.55 20.7,12.55 20.78,12.63 21.95,12.63 22.49,13.17 25.79,13.17 26.21,13.58 v1(26.5,13.58)
  Bottom Layer w0.216: v1(26.5,13.58) 26.5,13.88 26.68,14.05 26.68,14.45 arc(26.75,14.63) 26.93,14.71 27.02,14.71 arc(27.28,14.96) 27.02,15.21 26.93,15.21 arc(26.75,15.29) 26.68,15.47 26.68,15.55 26.98,15.85 v1(27.28,15.85)
HDMI_D2+: length 10.9
  Top Layer w0.216: CN1.1 29.49,15.27 29.16,14.95 28.37,14.95 28.14,15.18 25.1,15.18 24.55,15.73 22.91,15.73 21.66,14.47 20.78,14.47 20.7,14.55 20.07,14.55
HDMI_D2-: length 10.9
  Top Layer w0.216: 20.07,14.05 20.7,14.05 20.78,14.13 21.8,14.13 23.06,15.38 24.41,15.38 24.96,14.84 28,14.84 28.23,14.6 29.16,14.6 29.49,14.27 CN1.3
HDMI_HPD: length 13.8
  Top Layer w0.254: 16.94,8.92 16.94,4.81 18.72,3.03 25.15,3.03 R9.2
HDMI_SCL: length 14.4
  Top Layer w0.254: v1(20.76,6.2) 19.94,6.2 R11.1 19.87,6.84 18.44,8.26 18.44,8.92 ; v1(26.98,7.47) 27.78,8.27 CN1.15
  Bottom Layer w0.254: v1(20.76,6.2) 25.71,6.2 v1(26.98,7.47)
HDMI_SDA: length 26.9
  Top Layer w0.254: R8.2 v1(18.72,6.71) 18.72,7.22 17.94,8 17.94,8.92
  Bottom Layer w0.254: CN1.16 32.65,7.77 32.92,7.5 32.92,2.5 32.21,1.78 27.46,1.78 23.8,5.44 20.5,5.44 19.23,6.71 v1(18.72,6.71)
KEY: length 17.7
  Top Layer w0.254: SW1.2 4.92,21.57 v1(5.77,21.57) ; v1(17.84,16.49) 17.94,16.38 U3.16
  Bottom Layer w0.254: v1(5.77,21.57) 11.87,21.57 12.12,21.31 12.12,19.79 15.42,16.49 v1(17.84,16.49)
RX5V: length 22.8
  Top Layer w0.254: v1(25.71,4.42) 25.2,4.42 24.16,3.38 20.53,3.38 19.87,4.04 R11.2 R8.1 R3.1
  Bottom Layer w0.254: CN1.18 32.57,5.01 32.57,2.65 32.06,2.14 28.38,2.14 26.09,4.42 v1(25.71,4.42)
$1N3947: length 1.9
  Top Layer w0.381: R1.1 3.85,12.81 C7.2
$1N4157: length 5.4
  Top Layer w0.254: R9.1 27.23,3.53 v1(27.74,4.04)
  Bottom Layer w0.254: CN1.19 29.93,6.2 28.5,6.2 27.74,5.44 v1(27.74,4.04)
$1N4897: length 6.9
  Top Layer w0.254: R14.1 19.66,17.05 v1(19.23,16.62) 18.94,16.33 U3.14
  Bottom Layer w0.254: U4.6 19.23,17.72 v1(19.23,16.62)
$1N4904: length 8.6
  Top Layer w0.254: R13.1 19.84,21.7 20.4,21.14 20.4,16.89 v1(20.12,16.62) 20.12,16.38 U3.13
  Bottom Layer w0.254: v1(20.12,16.62) 20.12,17.34 U4.5 ; 20.77,17.86 20.88,17.97
$1N5015: length 8.7
  Top Layer w0.254: 13.32,14.55 12.28,14.55 9.71,17.12 C16.2 9.24,16.74 7.52,16.74 6.42,17.84
$1N5018: length 5.9
  Top Layer w0.254: X1.3 9.59,15.64 C15.1 10.31,15.76 12.02,14.05 13.32,14.05
$1N5095: length 3.6
  Top Layer w0.254: 11.36,17.5 11.36,16.36 12.67,15.05 13.32,15.05
$1N5166: length 3.6
  Top Layer w0.254: 13.32,13.05 11.85,13.05 10.6,11.79 R7.1
$1N5224: length 5.8
  Top Layer w0.254: R4.1 23.17,7.47 21.72,8.92 19.44,8.92
$1N5407: length 2.9
  Top Layer w0.254: 17.44,8.92 17.44,7.48 17.71,7.22 R3.2
$1N5897: length 3.1
  Top Layer w0.254: R16.2 13.52,17.5 14.44,16.58 14.44,15.67
$1N6045: length 3.2
  Top Layer w0.254: R15.2 18.11,18.09 18.44,17.76 18.44,15.67
$1N6128: length 2.5
  Top Layer w0.254: R10.1 21.01,16.69 21.01,15.35 20.71,15.05 20.07,15.05
$1N14503: length 3.4
  Top Layer w0.254: SW1.1 9.76,20.91 R6.1
$1N14505: length 8.7
  Top Layer w0.254: SW1.3 2.76,20.64 3.87,19.54 9.66,19.54 R5.1

## Copper pours and planes (outline as drawn; the poured copper is in the pictures)
GND on Top Layer: -4.26,26.39 41.2,26.39 41.2,-5.86 -4.26,-5.86
GND on Bottom Layer: -3.88,32.49 43.36,32.49 43.36,-12.85 -3.88,-12.85

Small or netless copper shapes (teardrops, artwork), in the pictures only: 152 on Top Layer, 58 on Bottom Layer

## Text on the board
Top Silkscreen Layer: AV GND | AVOUT 5VIN GND | NTSC<->PAL | HDMI->AV
